# EAGLE design SAM2695 @ Ard_V3_July 2015 (EAGLE 7.2.0)
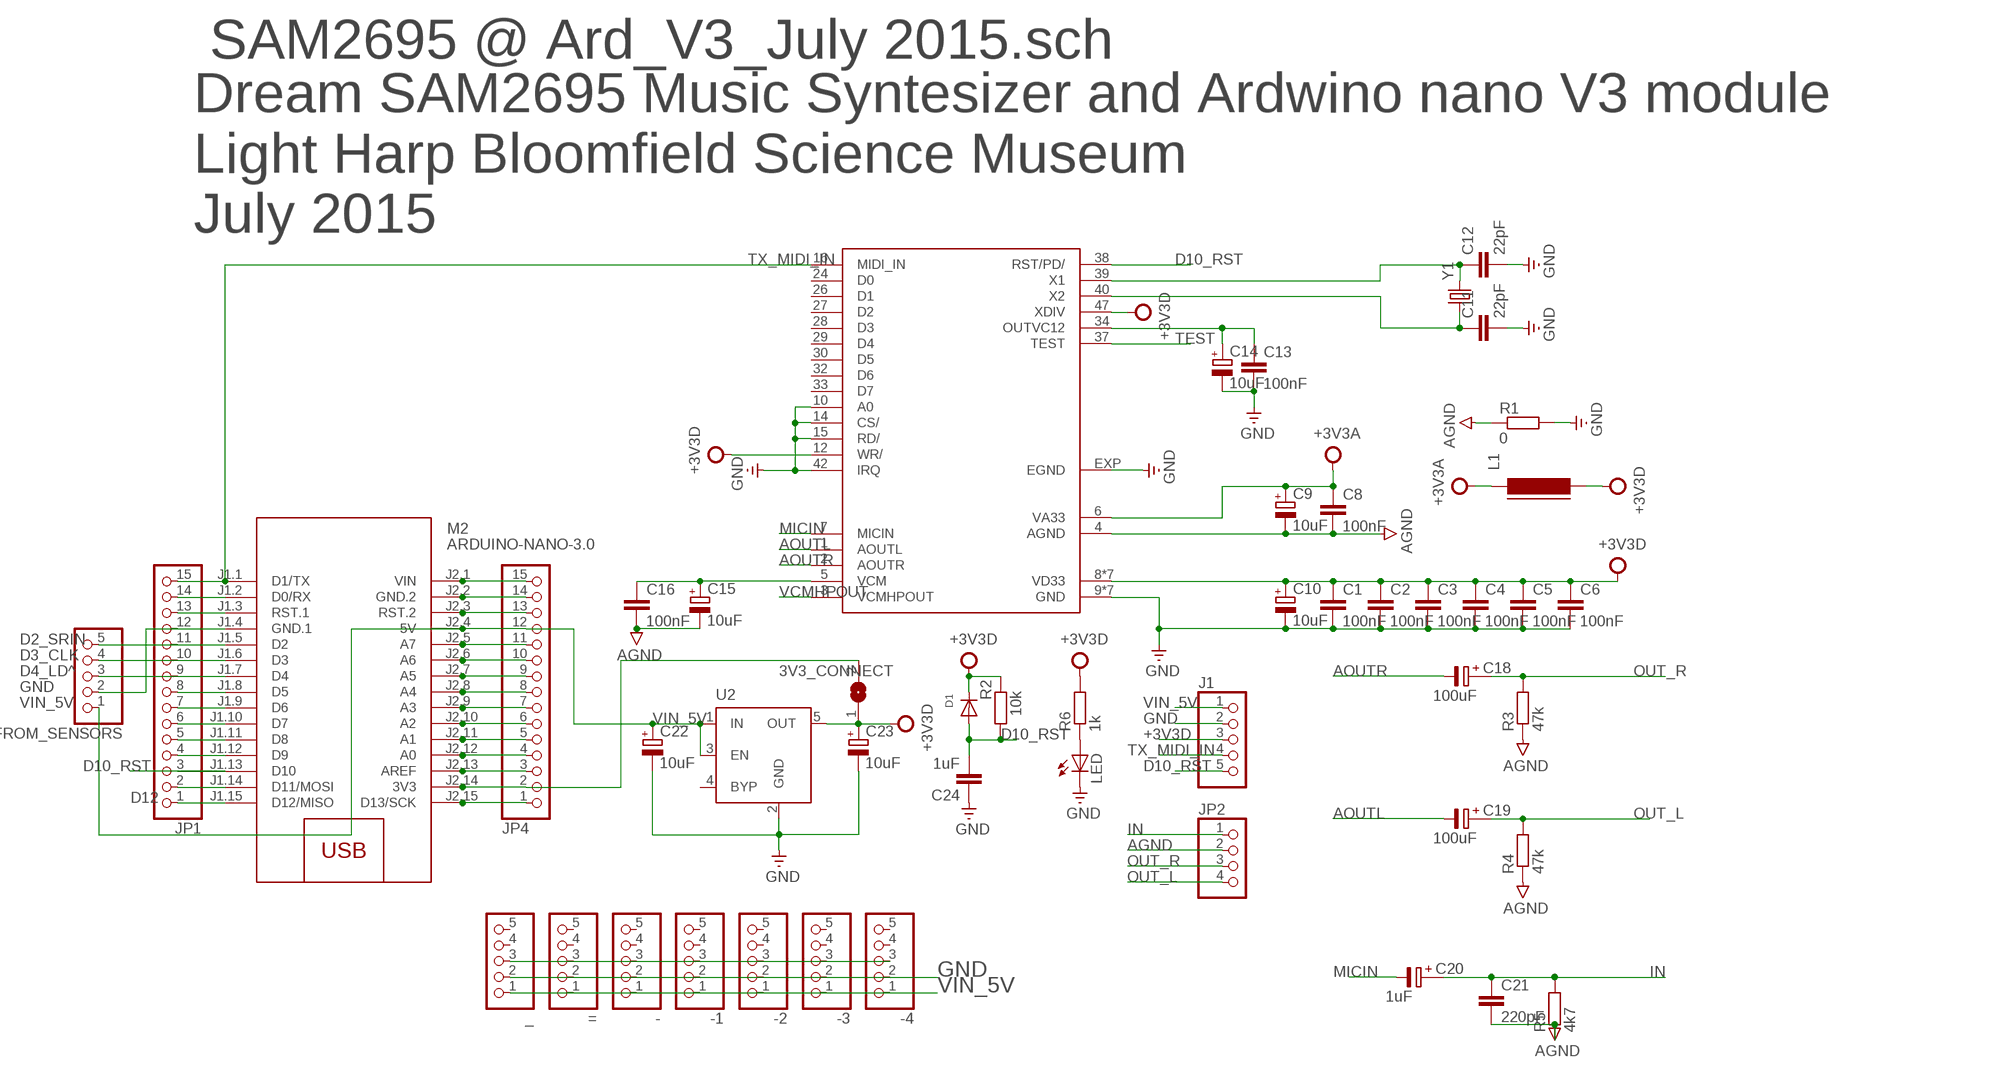
[diagram p0: schematic, sheet 1]

## Parts
3V3_CONNECT  SJ  [SJ]
-  PIN_HEAD_1X5_MARKED  [1X5_MARKED]
-1  PIN_HEAD_1X5_MARKED  [1X5_MARKED]
-2  PIN_HEAD_1X5_MARKED  [1X5_MARKED]
-3  PIN_HEAD_1X5_MARKED  [1X5_MARKED]
-4  PIN_HEAD_1X5_MARKED  [1X5_MARKED]
=  PIN_HEAD_1X5_MARKED  [1X5_MARKED]
_  PIN_HEAD_1X5_MARKED  [1X5_MARKED]
C1  100nF  C-EUC0603K  [C0603K]
C2  100nF  C-EUC0603K  [C0603K]
C3  100nF  C-EUC0603K  [C0603K]
C4  100nF  C-EUC0603K  [C0603K]
C5  100nF  C-EUC0603K  [C0603K]
C6  100nF  C-EUC0603K  [C0603K]
C8  100nF  C-EUC0603K  [C0603K]
C9  10uF  CPOL-EUA/3216-18R  [A/3216-18R]
C10  10uF  CPOL-EUA/3216-18R  [A/3216-18R]
C11  22pF  C-EUC0603K  [C0603K]
C12  22pF  C-EUC0603K  [C0603K]
C13  100nF  C-EUC0603K  [C0603K]
C14  10uF  CPOL-EUA/3216-18R  [A/3216-18R]
C15  10uF  CPOL-EUA/3216-18R  [A/3216-18R]
C16  100nF  C-EUC0603K  [C0603K]
C18  100uF  C-PR-SMD-SV-B  [SV-B]
C19  100uF  C-PR-SMD-SV-B  [SV-B]
C20  1uF  C-PR-SMD-SV-B  [SV-B]
C21  220pF  C-EUC0603K  [C0603K]
C22  10uF  CPOL-EUA/3216-18R  [A/3216-18R]
C23  10uF  CPOL-EUA/3216-18R  [A/3216-18R]
C24  1uF  C-EUC0603  [C0603]
D1  DIODESOD-123  [SOD-123]
FROM_SENSORS  PIN_HEAD_1X5_MARKED  [1X5_MARKED]
J1  PIN_HEAD_1X5_MARKED  [1X5_MARKED]
JP1  PINHD-1X15  [1X15]
JP2  HEADER-1X4ROUND  [1X04_ROUND]
JP4  PINHD-1X15  [1X15]
L1  FERRITE-0603  [FB603]
LED  LEDCHIP-LED0603  [CHIP-LED0603]
M2  ARDUINO-NANO-3.0  [ARDUINO-NANO-3.0]
R1  0  R-EU_R0603  [R0603]
R2  10k  R-EU_R0603  [R0603]
R3  47k  R-EU_R0603  [R0603]
R4  47k  R-EU_R0603  [R0603]
R5  4k7  R-EU_R0603  [R0603]
R6  1k  R-EU_R0603  [R0603]
U2  MIC5219XX  [SOT23-5]
U$2  SAM2695LONG_PAD  [QFN48_LONG_PAD]
Y1  CRYSTALTXC-7A  [CRYSTAL-TXC-7A]

## Nets
+3V3A: C8.1 C9.+ L1.1 U$2.6(VA33)
+3V3D: 3V3_CONNECT.1 C1.1 C2.1 C3.1 C4.1 C5.1 C6.1 C10.+ C23.+ D1.C J1.3 L1.2 R2.2 R6.2 U2.5(OUT) U$2.8(VD33) U$2.11(VD33) U$2.12(WR/) U$2.20(VD33) U$2.31(VD33) U$2.35(VD33) U$2.41(VD33) U$2.46(VD33) U$2.47(XDIV)
AGND: C8.2 C9.- C15.- C16.2 C21.2 JP2.2 R1.1 R3.1 R4.1 R5.1 U$2.4(AGND)
AOUTL: C19.- U$2.1(AOUTL)
AOUTR: C18.- U$2.2(AOUTR)
D2_SRIN: FROM_SENSORS.5 JP1.11 M2.J1.5(D2)
D3_CLK: FROM_SENSORS.4 JP1.10 M2.J1.6(D3)
D4_LD^: FROM_SENSORS.3 JP1.9 M2.J1.7(D4)
D5: JP1.8 M2.J1.8(D5)
D6: JP1.7 M2.J1.9(D6)
D7: JP1.6 M2.J1.10(D7)
D8: JP1.5 M2.J1.11(D8)
D9: JP1.4 M2.J1.12(D9)
D10_RST: C24.2 D1.A J1.5 JP1.3 M2.J1.13(D10) R2.1 U$2.38(RST/PD/)
D11: JP1.2 M2.J1.14(D11/MOSI)
D12: JP1.1 M2.J1.15(D12/MISO)
D13: JP4.1 M2.J2.15(D13/SCK)
GND: -1.2 -2.2 -3.2 -4.2 -.2 =.2 _.2 C1.2 C2.2 C3.2 C4.2 C5.2 C6.2 C10.- C11.2 C12.2 C13.2 C14.- C22.- C23.- C24.1 FROM_SENSORS.2 J1.2 JP1.12 JP4.14 LED.C M2.J1.4(GND.1) M2.J2.2(GND.2) R1.2 U2.2(GND) U$2.9(GND) U$2.10(A0) U$2.13(GND) U$2.14(CS/) U$2.15(RD/) U$2.18(GND) U$2.25(GND) U$2.36(GND) U$2.42(IRQ) U$2.45(GND) U$2.48(GND) U$2.EXP(EGND)
IN: C20.+ C21.1 JP2.1 R5.2
MICIN: C20.- U$2.7(MICIN)
N$1: -1.3 -2.3 -3.3 -4.3 -.3 =.3 _.3
N$2: C13.1 C14.+ U$2.34(OUTVC12)
N$3: C12.1 U$2.39(X1) Y1.P$2
N$4: C11.1 U$2.40(X2) Y1.P$1
N$5: LED.A R6.1
N$6: C15.+ C16.1 U$2.5(VCM)
N$8: 3V3_CONNECT.2 JP4.2 M2.J2.14(3V3)
N$10: JP4.3 M2.J2.13(AREF)
N$11: JP4.4 M2.J2.12(A0)
N$12: JP4.5 M2.J2.11(A1)
N$13: JP4.6 M2.J2.10(A2)
N$14: JP4.7 M2.J2.9(A3)
N$15: JP4.8 M2.J2.8(A4)
N$16: JP4.9 M2.J2.7(A5)
N$17: JP4.10 M2.J2.6(A6)
N$18: JP4.11 M2.J2.5(A7)
N$21: JP4.15 M2.J2.1(VIN)
OUT_L: C19.+ JP2.4 R4.2
OUT_R: C18.+ JP2.3 R3.2
RST1_ARD: JP1.13 M2.J1.3(RST.1)
RST2_ARD: JP4.13 M2.J2.3(RST.2)
RX: JP1.14 M2.J1.2(D0/RX)
TEST: U$2.37(TEST)
TX_MIDI_IN: J1.4 JP1.15 M2.J1.1(D1/TX) U$2.16(MIDI_IN)
VCMHPOUT: U$2.3(VCMHPOUT)
VIN_5V: -1.1 -2.1 -3.1 -4.1 -.1 =.1 _.1 C22.+ FROM_SENSORS.1 J1.1 JP4.12 M2.J2.4(5V) U2.1(IN) U2.3(EN)
Unconnected: -1.4 -1.5 -2.4 -2.5 -3.4 -3.5 -4.4 -4.5 -.4 -.5 =.4 =.5 _.4 _.5 U2.4(BYP) U$2.24(D0) U$2.26(D1) U$2.27(D2) U$2.28(D3) U$2.29(D4) U$2.30(D5) U$2.32(D6) U$2.33(D7)

## Notes on the sheet
- SAM2695 @ Ard_V3_July 2015.sch
- Dream SAM2695 Music Syntesizer and Ardwino nano V3 module
  Light Harp Bloomfield Science Museum 
  July 2015

## Library data of the parts
3V3_CONNECT = jumper:SJ: SMD solder JUMPER
- -1--4 = _ FROM_SENSORS J1 = Amir_May_15:PIN_HEAD_1X5_MARKED
C1-C6 C8 C11-C13 C16 C21 C24 = rcl:C-EU: CAPACITOR, European symbol
C9 C10 C14 C15 C22 C23 = rcl:CPOL-EU: POLARIZED CAPACITOR, European symbol
C18-C20 = cap-pan40:C-PR: POLARIZED ELECTROLYTIC/TANTALUM
D1 = adafruit:DIODE: Diode SMADIODE - SMA Surface Mount Package 20V 1A Schottky Diode Digikey: 641-1014-6-ND DO-1N4148 - Through Hole Small Current Diode SOD-123 20V 1 A (.5mV Vf) Schottky Diode - Digikey: MBRX120TPMSCT-ND SOD-323 10V 570mA (.38mV Vf, 3ns) Schottky Diode - Digikey: ZLLS410CT-ND SOD-523 30V 30mA Schottky Diode (RB751S-40TE61) - Digikey: RB751S-40TE61CT-ND SOT23-R/W - SOT23 Package (R = Solder Paste/Reflow Ovens, W = Hand-Soldering) BAT54Film 40V 300mA - Digikey: 497-7162-1-ND
JP1 JP4 = pinhead:PINHD-1X15: PIN HEADER
JP2 = microbuilder:HEADER-1X4: PIN HEADER
L1 = dp_devices:FERRITE: Ferrite bead in various packages
LED = led:LED: LED OSRAM: - CHIPLED LG R971, LG N971, LY N971, LG Q971, LY Q971, LO R971, LY R971 LH N974, LH R974 LS Q976, LO Q976, LY Q976 LO Q996 - Hyper CHIPLED LW Q18S LB Q993, LB Q99A, LB R99A - SideLED LS A670, LO A670, LY A670, LG A670, LP A670 LB A673, LV A673, LT A673, LW A673 LH A674 LY A675 LS A676, LA A676, LO A676, LY A676, LW A676 LS A679, LY A679, LG A679 - Hyper Micro SIDELED® LS Y876, LA Y876, LO Y876, LY Y876 LT Y87S - SmartLED LW L88C, LW L88S LB L89C, LB L89S, LG L890 LS L89K, LO L89K, LY L89K LS L896, LA L896, LO L896, LY L896 - TOPLED LS T670, LO T670, LY T670, LG T670, LP T670 LSG T670, LSP T670, LSY T670, LOP T670, LYG T670 LG T671, LOG T671, LSG T671 LB T673, LV T673, LT T673, LW T673 LH T674 LS T676, LA T676, LO T676, LY T676, LB T676, LH T676, LSB T676, LW T676 LB T67C, LV T67C, LT T67C, LS T67K, LO T67K, LY T67K, LW E67C LS E67B, LA E67B, LO E67B, LY E67B, LB E67C, LV E67C, LT E67C LW T67C LS T679, LY T679, LG T679 LS T770, LO T770, LY T770, LG T770, LP T770 LB T773, LV T773, LT T773, LW T773 LH T774 LS E675, LA E675, LY E675, LS T675 LS T776, LA T776, LO T776, LY T776, LB T776 LHGB T686 LT T68C, LB T68C - Hyper Mini TOPLED® LB M676 - Mini TOPLED Santana® LG M470 LS M47K, LO M47K, LY M47K Source: http://www.osram.convergy.de LUXEON: - LUMILED® LXK2-PW12-R00, LXK2-PW12-S00, LXK2-PW14-U00, LXK2-PW14-V00 LXK2-PM12-R00, LXK2-PM12-S00, LXK2-PM14-U00 LXK2-PE12-Q00, LXK2-PE12-R00, LXK2-PE12-S00, LXK2-PE14-T00, LXK2-PE14-U00 LXK2-PB12-K00, LXK2-PB12-L00, LXK2-PB12-M00, LXK2-PB14-N00, LXK2-PB14-P00, LXK2-PB14-Q00 LXK2-PR12-L00, LXK2-PR12-M00, LXK2-PR14-Q00, LXK2-PR14-R00 LXK2-PD12-Q00, LXK2-PD12-R00, LXK2-PD12-S00 LXK2-PH12-R00, LXK2-PH12-S00 LXK2-PL12-P00, LXK2-PL12-Q00, LXK2-PL12-R00 Source: www.luxeon.com KINGBRIGHT: KA-3528ASYC Source: www.kingbright.com
M2 = diy-modules:ARDUINO-NANO-3.0: Arduino Nano 3.0
R1-R6 = rcl:R-EU_: RESISTOR, European symbol
U2 = v-reg-micrel:MIC5219XX: VOLTAGE REGULATOR; OC_FARNELL: unknown; OC_NEWARK: unknown
U$2 = Amir_May_15:SAM2695
Y1 = SparkFun-FreqCtrl:CRYSTAL: Various standard crystals. Proven footprints. Spark Fun Electronics SKU : COM-00534

## Net classes
1 GND: width 0.305 mm
2 VCC: width 0.305 mm
3 VBUS: width 0.508 mm

## Board
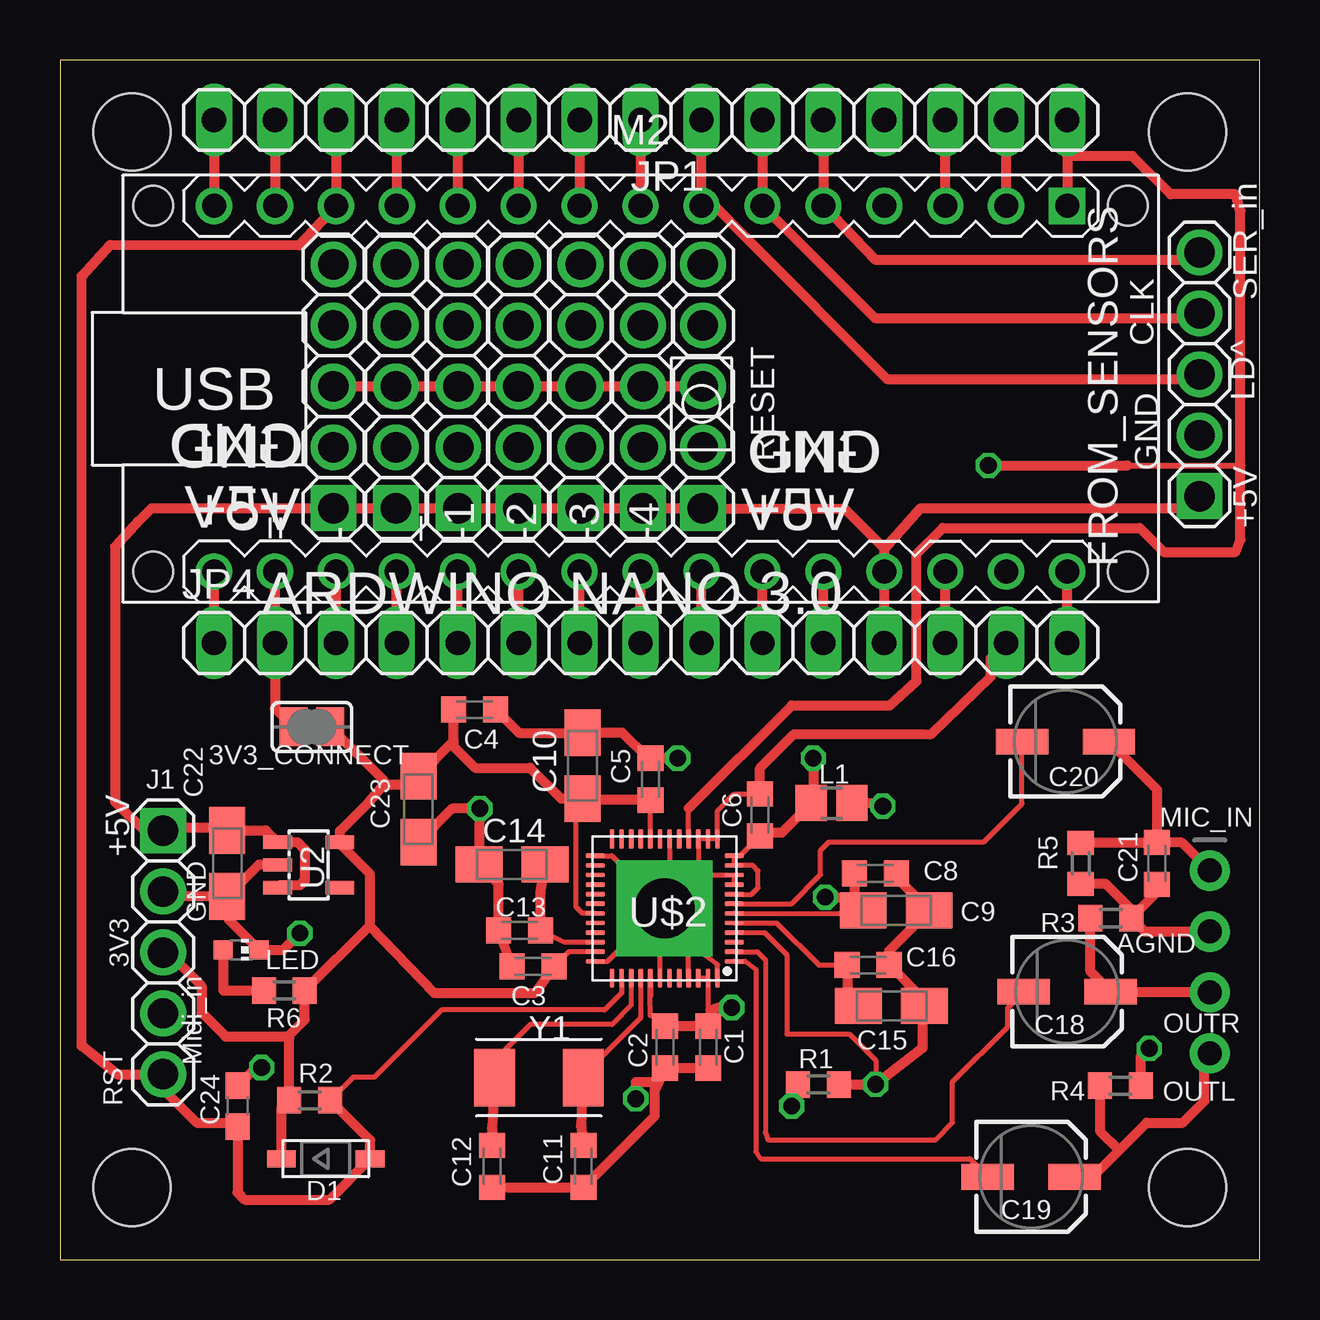
[diagram p1: board, top side]
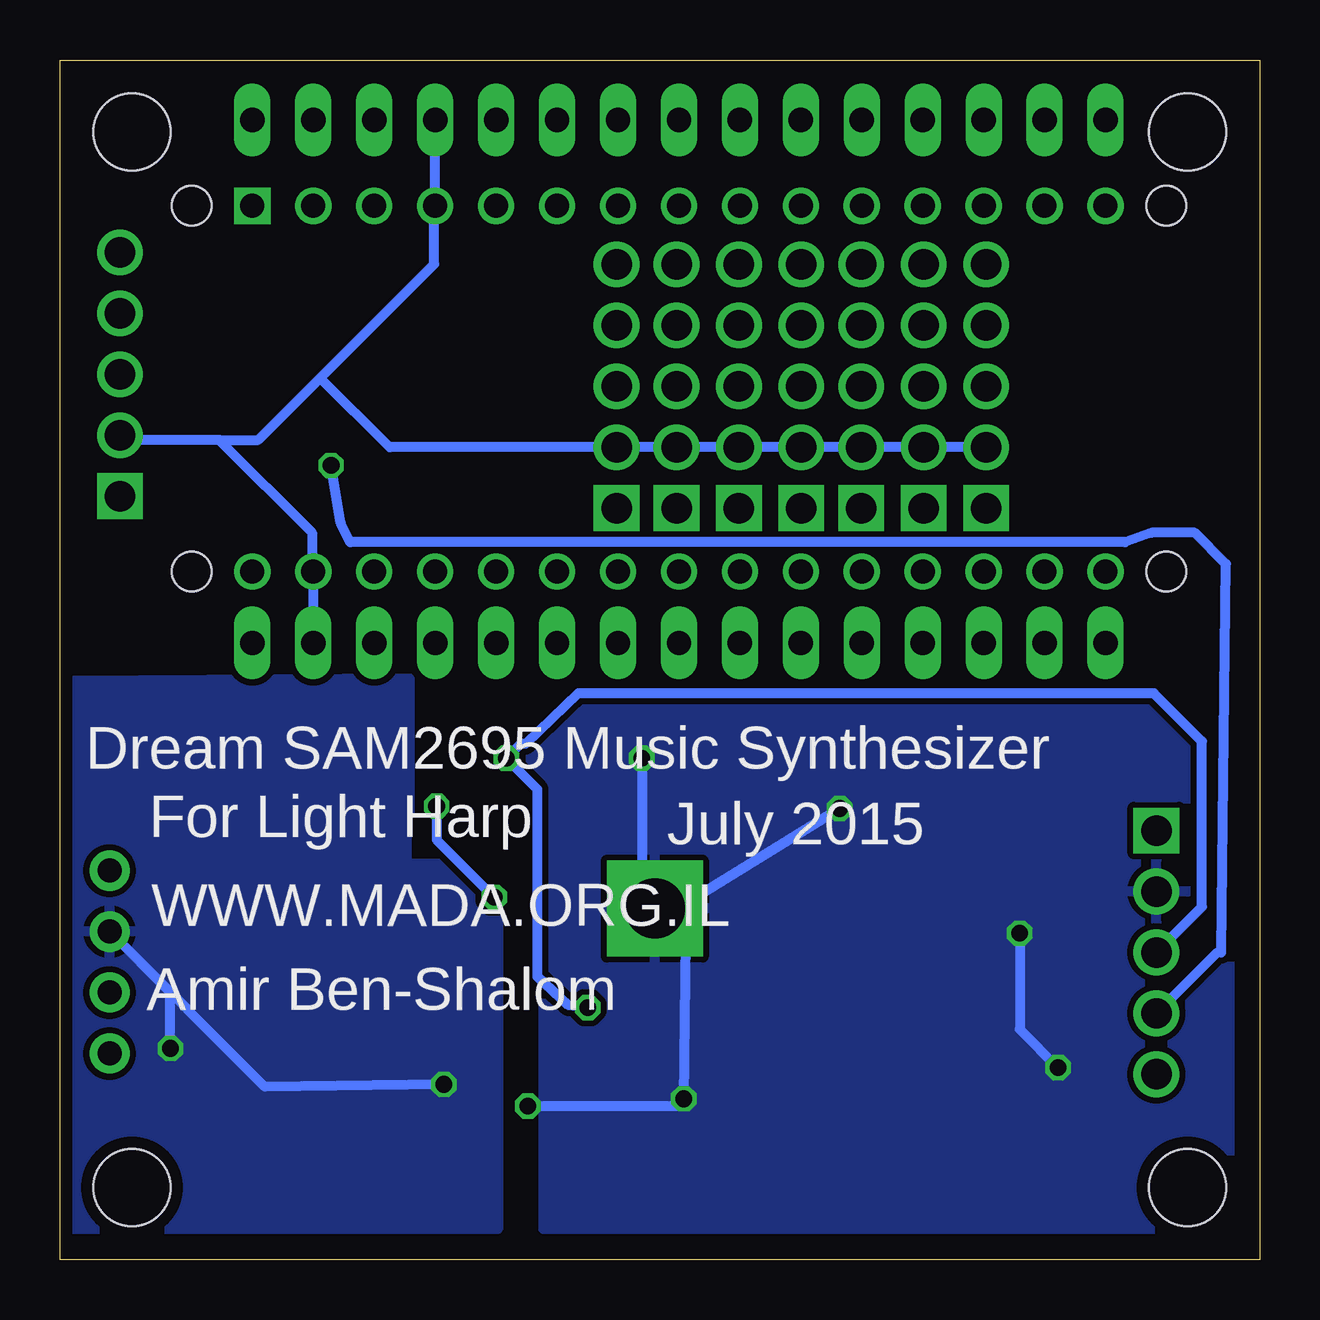
[diagram p2: board, bottom side, seen from below]

Size 50 x 50 mm. Coordinates in mm from the lower left corner, seen from the top.
Outline: 0,0 50,0 50,50 0,50 0,0
Copper layers (1*16): Top 0.035mm / dielectric 1.5mm / Bottom 0.035mm
Design rules "Smart-prototyping": minimum track width 7mil, minimum drill 12mil, track to track 7mil, track to pad 7mil, pad to pad 7mil, via to via 7mil, smd to smd 0mil, copper to edge 20mil, drill to drill 10mil, minimum pad ring 10mil, minimum via ring 6mil, stop-mask expansion 2mil, vias tented up to drill 25mil, thermal gap 10mil
Holes 3.2 mm at 47,3 47,47 3,47 3,3

### Footprints (pad centres in the part's own frame; a part is rotated, then mirrored left to right if it is on the bottom)
SJ = smd 1.168 x 1.6: 1 -0.762,0; 2 0.762,0
1X5_MARKED = drill 1.27 square: 1 -5.08,0 | drill 1.27: 2 -2.54,0; 3 0,0; 4 2.54,0; 5 5.08,0
C0603K = smd 1.05 x 1.08: 1 -0.875,0; 2 0.875,0
A/3216-18R = smd 1.95 x 1.5: + 1.375,0; - -1.375,0
SV-B = smd 2.184 x 1.067: + -1.81,0; - 1.81,0
C0603 = smd 1.1 x 1: 1 -0.85,0; 2 0.85,0
SOD-123 = smd 1.2 x 0.7: A 1.85,0; C -1.85,0
1X15 = drill 1.016 long: 1 -17.78,0; 2 -15.24,0; 3 -12.7,0; 4 -10.16,0; 5 -7.62,0; 6 -5.08,0; 7 -2.54,0; 8 0,0; 9 2.54,0; 10 5.08,0; 11 7.62,0; 12 10.16,0; 13 12.7,0; 14 15.24,0; 15 17.78,0
1X04_ROUND = drill 1 pad 1.676: 1 -3.81,0; 2 -1.27,0; 3 1.27,0; 4 3.81,0
FB603 = smd 1.3 x 1.5: 1 -0.85,0; 2 0.85,0
CHIP-LED0603 = smd 0.8 x 0.8: A 0,-0.75; C 0,0.75
ARDUINO-NANO-3.0 = drill 1 square: J1.1 17.78,7.62 | drill 1: J1.2 15.24,7.62; J1.3 12.7,7.62; J1.4 10.16,7.62; J1.5 7.62,7.62; J1.6 5.08,7.62; J1.7 2.54,7.62; J1.8 0,7.62; J1.9 -2.54,7.62; J1.10 -5.08,7.62; J1.11 -7.62,7.62; J1.12 -10.16,7.62; J1.13 -12.7,7.62; J1.14 -15.24,7.62; J1.15 -17.78,7.62; J2.1 17.78,-7.62; J2.2 15.24,-7.62; J2.3 12.7,-7.62; J2.4 10.16,-7.62; J2.5 7.62,-7.62; J2.6 5.08,-7.62; J2.7 2.54,-7.62; J2.8 0,-7.62; J2.9 -2.54,-7.62; J2.10 -5.08,-7.62; J2.11 -7.62,-7.62; J2.12 -10.16,-7.62; J2.13 -12.7,-7.62; J2.14 -15.24,-7.62; J2.15 -17.78,-7.62 | hole 1.651: -20.32,7.62; -20.32,-7.62; 20.32,-7.62; 20.32,7.62
R0603 = smd 1 x 1.1: 1 -0.85,0; 2 0.85,0
SOT23-5 = smd 0.55 x 1.2: 1 -0.95,-1.3; 2 0,-1.3; 3 0.95,-1.3; 4 0.95,1.3; 5 -0.95,1.3
QFN48_LONG_PAD = smd 0.8 x 0.2: 1 -2.9,2.3; 2 -2.9,1.9; 3 -2.9,1.5; 4 -2.9,1.1; 5 -2.9,0.7; 6 -2.9,0.3; 7 -2.9,-0.1; 8 -2.9,-0.5; 9 -2.9,-0.9; 10 -2.9,-1.3; 11 -2.9,-1.7; 12 -2.9,-2.1; 25 2.9,-2.1; 26 2.9,-1.7; 27 2.9,-1.3; 28 2.9,-0.9; 29 2.9,-0.5; 30 2.9,-0.1; 31 2.9,0.3; 32 2.9,0.7; 33 2.9,1.1; 34 2.9,1.5; 35 2.9,1.9; 36 2.9,2.3 | smd 0.2 x 0.8: 13 -2.2,-2.8; 14 -1.8,-2.8; 15 -1.4,-2.8; 16 -1,-2.8; 17 -0.6,-2.8; 18 -0.2,-2.8; 19 0.2,-2.8; 20 0.6,-2.8; 21 1,-2.8; 22 1.4,-2.8; 23 1.8,-2.8; 24 2.2,-2.8; 37 2.2,3; 38 1.8,3; 39 1.4,3; 40 1,3; 41 0.6,3; 42 0.2,3; 43 -0.2,3; 44 -0.6,3; 45 -1,3; 46 -1.4,3; 47 -1.8,3; 48 -2.2,3 | drill 2.5 pad 4 square: EXP 0,0.1
CRYSTAL-TXC-7A = smd 1.7 x 2.4: P$1 1.85,0; P$2 -1.85,0

### Placement (x,y rotation side)
3V3_CONNECT  10.5,22.2 180 top
-  14,36.4 90 top
-1  19.1,36.4 90 top
-2  21.7,36.4 90 top
-3  24.3,36.4 90 top
-4  26.8,36.4 90 top
=  11.4,36.4 90 top
_  16.6,36.4 90 top
C1  27.02,8.86 270 top
C2  25.22,8.86 270 top
C3  19.71,12.22 180 top
C4  17.29,22.92 0 top
C5  24.61,20.02 90 top
C6  29.18,18.54 90 top
C8  33.98,16.1 0 top
C9  34.85,14.55 180 top
C10  21.79,20.58 270 top
C11  21.82,3.89 270 top
C12  18.02,3.89 270 top
C13  19.16,13.72 180 top
C14  18.84,16.48 0 top
C15  34.66,10.57 180 top
C16  33.69,12.27 0 top
C18  41.98,11.16 180 top
C19  40.48,3.45 180 top
C20  41.91,21.59 180 top
C21  45.72,16.51 270 top
C22  6.97,16.52 90 top
C23  14.94,18.77 90 top
C24  7.4,6.4 270 top
D1  11.08,4.2 0 top
FROM_SENSORS  47.5,36.9 90 top
J1  4.3,12.8 270 top
JP1  24.2,47.5 0 top
JP2  47.93,12.4 270 top
JP4  24.2,25.7 0 top
L1  32.16,19.03 180 top
LED  7.55,12.91 270 top
M2  24.2,36.3 0 top
R1  31.61,7.29 180 top
R2  10.41,6.64 180 top
R3  43.8,14.23 180 top
R4  44.2,7.25 180 top
R5  42.55,16.51 90 top
R6  9.36,11.21 0 top
U2  10.37,16.45 270 top
U$2  25.21,14.73 180 top
Y1  19.96,7.58 0 top

### Tracks (layer width: path | path; a pad name or v marks a point on that pad's centre or on a via)
+3V3A  (via drill 0.7)
  Top 0.2: U$2.6 33.48,14.43 C9.+
  Top 0.406: C8.1 33.11,14.92 C9.+ 32.93,15.1 v31.9,15.1 | L1.1 34.17,19.03 v34.3,18.9
  Bottom 0.406: v34.3,18.9 34.3,17.5 v31.9,15.1
+3V3D  (via drill 0.7)
  Top 0.2: U$2.8 28.83,15.23 29.1,15.5 29.1,16.2 28.9,16.4 28.89,16.4 28.88,16.43 28.13,16.43 U$2.11 U$2.12 28.35,16.83 C6.1 | U$2.46 U$2.47 27.02,11.72 C1.1 | U$2.20 C5.1 | 24.61,10.94 U$2.41 24.6,11 24.61,10.17 C2.1 25.44,9.75 | U$2.35 21.2,12.83 C3.1 | U$2.31 21.77,14.43 21.5,14.7 21.5,18.92 C10.+
  Top 0.406: 25.44,9.75 27,9.75 C1.1 27.06,9.69 27.11,10.39 27.41,10.51 v28,10.5 | C6.1 29.26,17.66 29.4,17.8 30.09,17.8 L1.2 31.4,19.11 v31.4,20.9 | 13.5,19.8 12.9,19.1 11.67,17.87 U2.5 11.67,17.33 12.9,16.1 12.9,13.91 | 13.5,19.8 14.19,19.8 C23.+ 16.41,21.61 | 10.93,22.1 3V3_CONNECT.1 13.5,19.96 13.5,19.8 | 9.5,9.3 6.9,9.3 5.9,10.3 5.9,11.4 4.5,12.8 J1.3 | 9.5,9.3 10.2,10 R6.2 12.9,13.91 | C3.1 19.8,11.1 15.61,11.1 12.9,13.91 | C5.1 21.25,19.15 21.2,19.2 | 21.2,19.2 C10.+ | D1.C 9.23,6.31 R2.2 9.56,9.24 9.5,9.3 | 16.41,21.61 C4.1 | 16.41,21.61 16.41,21.39 17.31,20.49 19.6,20.5 20.9,19.2 21.2,19.2
  Bottom 0.406: v28,10.5 28.8,10.6 30.1,11.8 30.1,19.6 v31.4,20.9 30.8,21.5 30.6,21.5 28.4,23.6 4.4,23.6 2.4,21.6 2.4,14.7 J1.3
AGND  (via drill 0.7)
  Top 0.2: U$2.4 29.37,13.63 30.3,12.7 30.3,9.4 32.9,9.4 34,8.3 v34,7.3
  Top 0.406: R3.1 45.21,13.67 JP2.2 | C8.2 34.8,16.1 34.9,16.2 34.9,15.88 C9.- 34.56,12.88 C16.2 36.03,10.8 C15.- 35.97,10.5 35.97,8.81 v34,7.3 v33.99,7.29 R1.1 | R3.1 45.72,15.3 C21.2 | R3.1 44.65,14.6 43.6,15.65 R5.1 | R4.1 45.05,8.45 v45.4,8.8
  Bottom 0.406: v34,7.3 41.46,7.2 JP2.2 45.4,11.14 v45.4,8.8
  pour Bottom (isolate 0.254): 31.75,16.51 31.75,1.27 49.53,1.27 49.53,24.13 35.44,24.23 35.44,18.52 35.56,18.41 35.56,16.51
AOUTL
  Top 0.2: C19.- 37.92,4.2 29.2,4.2 29,4.5 29,12.1 28.57,12.43 U$2.1
AOUTR
  Top 0.2: U$2.2 29.07,12.83 29.4,12.5 29.4,5.3 29.5,5 36.5,5 37.2,5.7 37.2,7.4 39.5,9.7 39.5,10.49 C18.-
D2_SRIN
  Top 0.406: JP1.11 M2.J1.5 33.96,41.68 47.2,41.68 FROM_SENSORS.5
D3_CLK
  Top 0.406: JP1.10 M2.J1.6 33.96,39.24 47.3,39.24 FROM_SENSORS.4
D4_LD^
  Top 0.406: JP1.9 M2.J1.7 27.28,43.92 28.6,42.6 34.46,36.7 47.3,36.7 FROM_SENSORS.3
D5
  Top 0.406: JP1.8 M2.J1.8
D6
  Top 0.406: JP1.7 M2.J1.9
D7
  Top 0.406: JP1.6 M2.J1.10
D8
  Top 0.406: JP1.5 M2.J1.11 | M2.J1.11 16.58,43.58 16.4,43.4 16.4,43.74 M2.J1.11
D9
  Top 0.406: JP1.4 M2.J1.12
D10_RST
  Top 0.2: U$2.38 23.41,11.11 22.7,10.4 15.9,10.4 13.1,7.6 12.22,7.6 R2.1
  Top 0.406: JP1.3 M2.J1.13 9.97,42.28 2.1,42.3 0.9,41 0.9,8.9 2.38,7.72 J1.5 4.3,7.1 5.7,5.7 7.25,5.7 C24.2 7.4,2.8 7.7,2.5 11.23,2.5 D1.A 12.93,4.97 R2.1
D11
  Top 0.406: JP1.2 M2.J1.14
D12
  Top 0.406: JP1.1 M2.J1.15
D13
  Top 0.406: JP4.1 M2.J2.15
GND  (via drill 0.7)
  Top 0.2: U$2.18 25.41,14.83 U$2.EXP | 26.61,16.03 U$2.15 U$2.14 U$2.13 27.41,18.71 28.1,19.4 C6.2 | 26.61,16.03 U$2.EXP | U$2.9 U$2.10 26.61,16.03 | U$2.25 23.01,16.83 U$2.EXP | U$2.48 27.41,12.29 26.8,12.75 26.8,13.04 26.21,13.63 | 26.21,13.63 U$2.EXP | U$2.45 26.21,13.63 | U$2.42 25.01,14.43 U$2.EXP | U$2.36 22.83,12.43 23.3,12.9 23.48,12.9 U$2.EXP
  Top 0.406: v25.75,20.9 C5.2 24.5,20.9 23.45,21.95 C10.- 19.12,21.95 C4.2 | C2.2 C1.2 | JP4.14 38.8,25.06 38.8,24.3 36.3,21.89 35.99,21.9 30.6,21.9 29.18,20.48 C6.2 | C3.2 C13.2 18.29,15.65 C14.- v17.5,18.8 16.34,18.8 C23.- | C12.2 C11.2 24.8,6 24.8,7.4 | 24.8,7.4 25.2,7.86 C2.2 | C2.2 24.82,7.12 | v24,6.7 24,7.4 24.8,7.4 | U2.2 8.29,16.45 C22.- | 6.67,15.44 C22.- | C22.- 4.5,15.14 J1.2 | C22.- 6.97,14.24 LED.C 9.31,12.91 v10,13.6 | v8.4,8 8.15,8 C24.1 | R1.2 30.77,6.67 v30.5,6.4
  Bottom 0.406: v25.75,20.9 25.75,15.17 U$2.EXP 24.84,14.26 | v17.5,18.8 24.84,14.26 | 24.84,14.26 23.9,13.32 v24,6.7 24.3,6.4 v30.5,6.4 | 43.36,34.16 39.5,30.3 39.5,28.74 M2.J2.2 JP4.14 | 43.36,34.16 41.74,34.16 39.15,36.75 | 39.15,36.75 34.4,41.5 34.4,43.88 M2.J1.4 JP1.12 | 43.36,34.16 47.3,34.16 FROM_SENSORS.2 | v10,13.6 10,9.6 v8.4,8 | =.2 -.2 _.2 -1.2 -2.2 -3.2 -4.2 36.26,33.86 39.15,36.75
  pour Bottom (isolate 0.254): 33.63,19.82 33.63,23.93 1.27,24.13 1.27,1.27 29.84,1.27 29.84,18.41 33.66,18.41 33.66,20.22
IN
  Top 0.406: JP2.1 46.76,17.39 C21.1 | C21.1 45.7,17.36 R5.2 | C20.+ 45.72,19.59 C21.1
MICIN
  Top 0.2: U$2.7 30.48,14.83 31.7,16.05 31.7,17.05 32.05,17.4 38.5,17.4 40.1,19 C20.-
N$1
  Top 0.406: =.3 -.3 _.3 -1.3 -2.3 -3.3 -4.3
N$2
  Top 0.2: U$2.34 21.03,13.23 C13.1
  Top 0.406: C13.1 20.04,15.29 C14.+
N$3
  Top 0.2: Y1.P$2 18,8.2 19.61,9.8 23,9.8 23.81,10.61 U$2.39
  Top 0.406: Y1.P$2 18.01,5.47 C12.1
N$4
  Top 0.2: U$2.40 24.21,10.08 22.32,8.2 21.7,8.2 Y1.P$1
  Top 0.406: Y1.P$1 21.71,5.57 C11.1
N$5
  Top 0.406: LED.A 6.8,11.21 R6.1
N$6
  Top 0.2: U$2.5 29.87,14.03 31.63,12.27 C16.1
  Top 0.406: C16.1 32.81,11.04 C15.+
N$8
  Top 0.406: M2.J2.14 JP4.2 8.96,22.98 3V3_CONNECT.2
N$10
  Top 0.406: JP4.3 M2.J2.13
N$11
  Top 0.406: JP4.4 M2.J2.12
N$12
  Top 0.406: JP4.5 M2.J2.11
N$13
  Top 0.406: JP4.6 M2.J2.10
N$14
  Top 0.406: JP4.7 M2.J2.9
N$15
  Top 0.406: JP4.8 M2.J2.8
N$16
  Top 0.406: JP4.9 M2.J2.7
N$17
  Top 0.406: JP4.10 M2.J2.6
N$18
  Top 0.406: JP4.11 M2.J2.5
N$21
  Top 0.406: JP4.15 M2.J2.1
OUT_L
  Top 0.406: C19.+ 43.05,3.45 44.15,4.55 | 44.15,4.55 45.3,5.7 46.8,5.7 47.7,6.6 47.7,8.36 JP2.4 | R4.2 43.35,5.35 44.15,4.55
OUT_R
  Top 0.406: JP2.3 47.9,11.16 C18.+ 42.95,12.01 R3.2
RST1_ARD
  Top 0.406: M2.J1.3 JP1.13
RST2_ARD
  Top 0.406: JP4.13 M2.J2.3
RX
  Top 0.406: M2.J1.2 JP1.14
TX_MIDI_IN  (via drill 0.7)
  Top 0.2: U$2.16 26.21,18.81 | 42,43.9 M2.J1.1
  Top 0.254: 44.5,33.1 49.2,33.1
  Top 0.406: JP1.15 41.98,46 | 41.98,46 M2.J1.1 | 26.21,18.81 30.5,23.1 34.6,23.1 35.7,24.1 35.7,29.4 36.8,30.5 45,30.5 46,29.5 49,29.5 49.2,30 49.2,33.1 49.2,43.7 49,44.4 46.3,44.4 44.7,46 41.98,46 | v38.7,33.1 44.5,33.1
  Bottom 0.406: v38.7,33.1 38.3,30.7 37.9,29.9 5.6,29.9 4.5,30.3 2.7,30.3 1.4,29 1.6,12.8 1.76,12.8 J1.4
VIN_5V
  Top 0.406: U2.3 9.17,15.6 10,15.6 10.2,15.8 10.2,17.1 9.9,17.4 U2.1 8.58,17.89 C22.+ 6.88,17.98 4.4,17.98 J1.1 3.5,17.88 2.3,19.08 2.3,29.7 3.3,30.8 3.82,31.32 =.1 -.1 _.1 -1.1 -2.1 -3.1 -4.1 26.8,31.3 32.7,31.3 34.36,29.64 | 34.36,29.64 M2.J2.4 JP4.12 | 34.36,29.64 35.87,31.32 46.8,31.32 FROM_SENSORS.1

### Text on the board
tNames: SER_in | CLK | LD^ | GND | GND | GND | GND | GND | +5V | +5V | +5V | +5V | +5V | ARDWINO NANO 3.0 | MIC_IN | +5V | GND | AGND | 3V3 | OUTR | Midi_in | OUTL | RST
bNames: Dream SAM2695 Music Synthesizer | For Light Harp | July 2015 | WWW.MADA.ORG.IL | Amir Ben-Shalom